# EAGLE design CharlieplexNameTag (EAGLE 7.5.0)
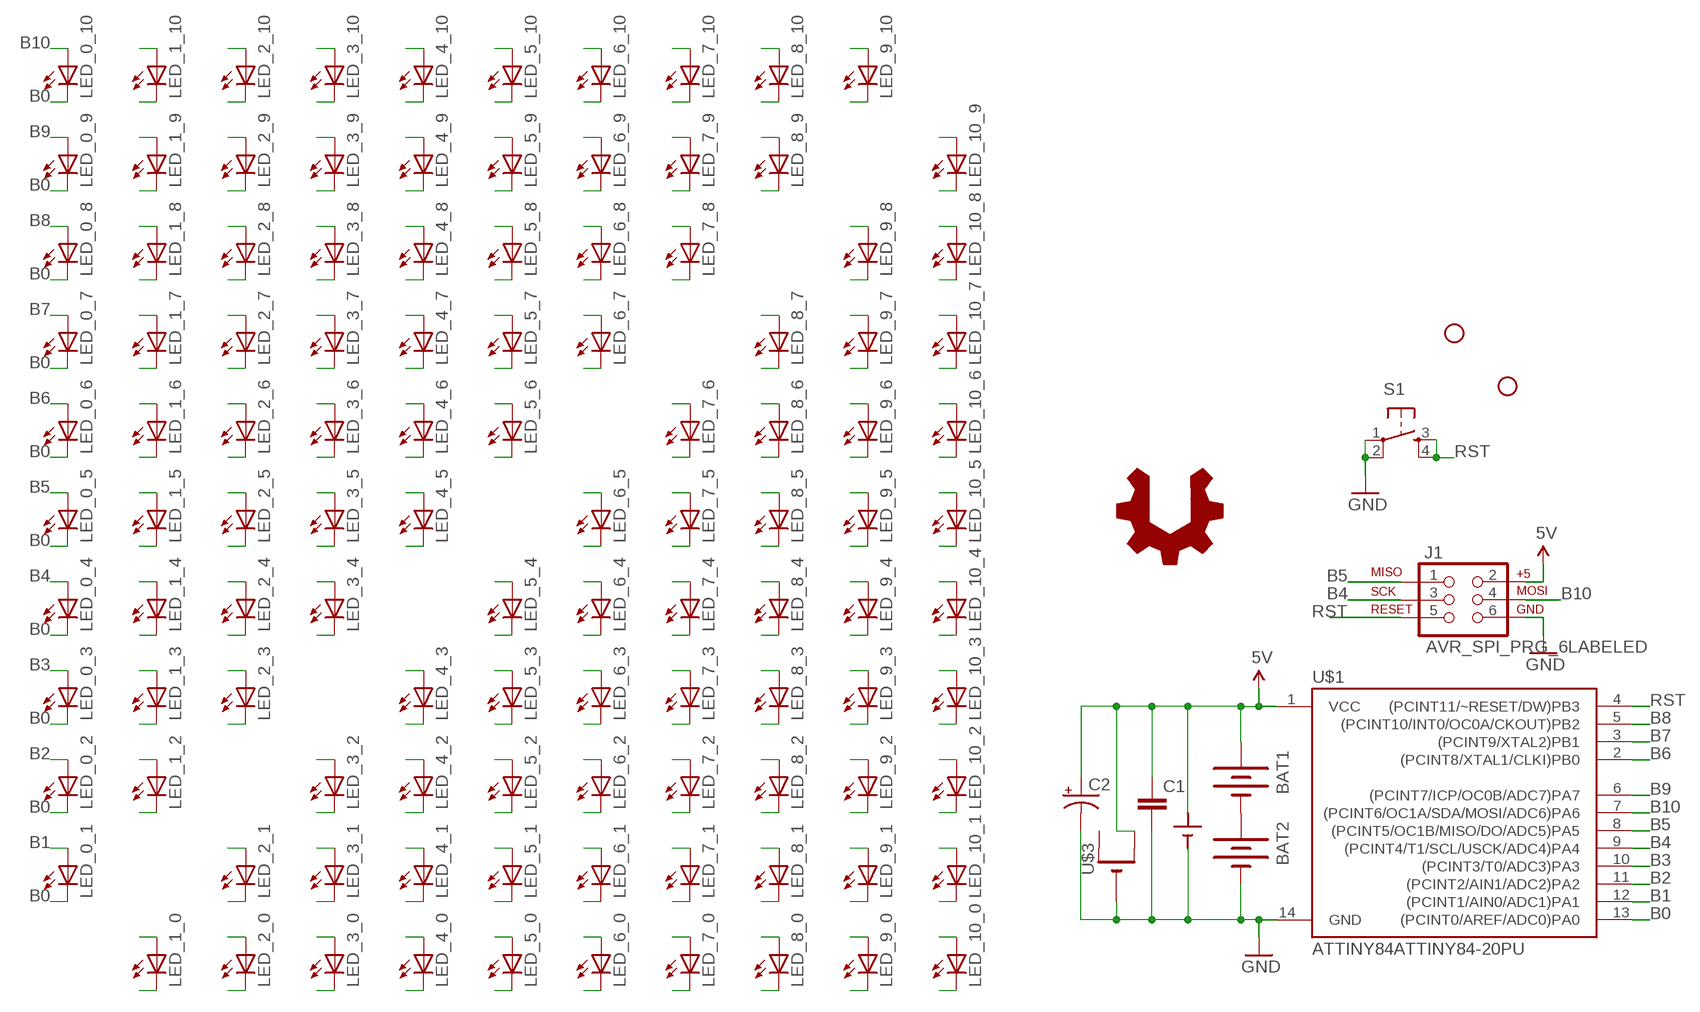
[diagram p0: schematic, sheet 1]

## Parts
BAT1  BATTERYAAA  [BATTERY-AAA]
BAT2  BATTERYAAA  [BATTERY-AAA]
C1  CAPPTH  [CAP-PTH-SMALL]
C2  CAP_POLPTH1  [CPOL-RADIAL-100UF-25V]
J1  AVR_SPI_PRG_6LABELED  [2X3-NS]
LED_0_1  LEDOVAL  [LED-OVAL]
LED_0_2  LEDOVAL  [LED-OVAL]
LED_0_3  LEDOVAL  [LED-OVAL]
LED_0_4  LEDOVAL  [LED-OVAL]
LED_0_5  LEDOVAL  [LED-OVAL]
LED_0_6  LEDOVAL  [LED-OVAL]
LED_0_7  LEDOVAL  [LED-OVAL]
LED_0_8  LEDOVAL  [LED-OVAL]
LED_0_9  LEDOVAL  [LED-OVAL]
LED_0_10  LEDOVAL  [LED-OVAL]
LED_1_0  LEDOVAL  [LED-OVAL]
LED_1_2  LEDOVAL  [LED-OVAL]
LED_1_3  LEDOVAL  [LED-OVAL]
LED_1_4  LEDOVAL  [LED-OVAL]
LED_1_5  LEDOVAL  [LED-OVAL]
LED_1_6  LEDOVAL  [LED-OVAL]
LED_1_7  LEDOVAL  [LED-OVAL]
LED_1_8  LEDOVAL  [LED-OVAL]
LED_1_9  LEDOVAL  [LED-OVAL]
LED_1_10  LEDOVAL  [LED-OVAL]
LED_2_0  LEDOVAL  [LED-OVAL]
LED_2_1  LEDOVAL  [LED-OVAL]
LED_2_3  LEDOVAL  [LED-OVAL]
LED_2_4  LEDOVAL  [LED-OVAL]
LED_2_5  LEDOVAL  [LED-OVAL]
LED_2_6  LEDOVAL  [LED-OVAL]
LED_2_7  LEDOVAL  [LED-OVAL]
LED_2_8  LEDOVAL  [LED-OVAL]
LED_2_9  LEDOVAL  [LED-OVAL]
LED_2_10  LEDOVAL  [LED-OVAL]
LED_3_0  LEDOVAL  [LED-OVAL]
LED_3_1  LEDOVAL  [LED-OVAL]
LED_3_2  LEDOVAL  [LED-OVAL]
LED_3_4  LEDOVAL  [LED-OVAL]
LED_3_5  LEDOVAL  [LED-OVAL]
LED_3_6  LEDOVAL  [LED-OVAL]
LED_3_7  LEDOVAL  [LED-OVAL]
LED_3_8  LEDOVAL  [LED-OVAL]
LED_3_9  LEDOVAL  [LED-OVAL]
LED_3_10  LEDOVAL  [LED-OVAL]
LED_4_0  LEDOVAL  [LED-OVAL]
LED_4_1  LEDOVAL  [LED-OVAL]
LED_4_2  LEDOVAL  [LED-OVAL]
LED_4_3  LEDOVAL  [LED-OVAL]
LED_4_5  LEDOVAL  [LED-OVAL]
LED_4_6  LEDOVAL  [LED-OVAL]
LED_4_7  LEDOVAL  [LED-OVAL]
LED_4_8  LEDOVAL  [LED-OVAL]
LED_4_9  LEDOVAL  [LED-OVAL]
LED_4_10  LEDOVAL  [LED-OVAL]
LED_5_0  LEDOVAL  [LED-OVAL]
LED_5_1  LEDOVAL  [LED-OVAL]
LED_5_2  LEDOVAL  [LED-OVAL]
LED_5_3  LEDOVAL  [LED-OVAL]
LED_5_4  LEDOVAL  [LED-OVAL]
LED_5_6  LEDOVAL  [LED-OVAL]
LED_5_7  LEDOVAL  [LED-OVAL]
LED_5_8  LEDOVAL  [LED-OVAL]
LED_5_9  LEDOVAL  [LED-OVAL]
LED_5_10  LEDOVAL  [LED-OVAL]
LED_6_0  LEDOVAL  [LED-OVAL]
LED_6_1  LEDOVAL  [LED-OVAL]
LED_6_2  LEDOVAL  [LED-OVAL]
LED_6_3  LEDOVAL  [LED-OVAL]
LED_6_4  LEDOVAL  [LED-OVAL]
LED_6_5  LEDOVAL  [LED-OVAL]
LED_6_7  LEDOVAL  [LED-OVAL]
LED_6_8  LEDOVAL  [LED-OVAL]
LED_6_9  LEDOVAL  [LED-OVAL]
LED_6_10  LEDOVAL  [LED-OVAL]
LED_7_0  LEDOVAL  [LED-OVAL]
LED_7_1  LEDOVAL  [LED-OVAL]
LED_7_2  LEDOVAL  [LED-OVAL]
LED_7_3  LEDOVAL  [LED-OVAL]
LED_7_4  LEDOVAL  [LED-OVAL]
LED_7_5  LEDOVAL  [LED-OVAL]
LED_7_6  LEDOVAL  [LED-OVAL]
LED_7_8  LEDOVAL  [LED-OVAL]
LED_7_9  LEDOVAL  [LED-OVAL]
LED_7_10  LEDOVAL  [LED-OVAL]
LED_8_0  LEDOVAL  [LED-OVAL]
LED_8_1  LEDOVAL  [LED-OVAL]
LED_8_2  LEDOVAL  [LED-OVAL]
LED_8_3  LEDOVAL  [LED-OVAL]
LED_8_4  LEDOVAL  [LED-OVAL]
LED_8_5  LEDOVAL  [LED-OVAL]
LED_8_6  LEDOVAL  [LED-OVAL]
LED_8_7  LEDOVAL  [LED-OVAL]
LED_8_9  LEDOVAL  [LED-OVAL]
LED_8_10  LEDOVAL  [LED-OVAL]
LED_9_0  LEDOVAL  [LED-OVAL]
LED_9_1  LEDOVAL  [LED-OVAL]
LED_9_2  LEDOVAL  [LED-OVAL]
LED_9_3  LEDOVAL  [LED-OVAL]
LED_9_4  LEDOVAL  [LED-OVAL]
LED_9_5  LEDOVAL  [LED-OVAL]
LED_9_6  LEDOVAL  [LED-OVAL]
LED_9_7  LEDOVAL  [LED-OVAL]
LED_9_8  LEDOVAL  [LED-OVAL]
LED_9_10  LEDOVAL  [LED-OVAL]
LED_10_0  LEDOVAL  [LED-OVAL]
LED_10_1  LEDOVAL  [LED-OVAL]
LED_10_2  LEDOVAL  [LED-OVAL]
LED_10_3  LEDOVAL  [LED-OVAL]
LED_10_4  LEDOVAL  [LED-OVAL]
LED_10_5  LEDOVAL  [LED-OVAL]
LED_10_6  LEDOVAL  [LED-OVAL]
LED_10_7  LEDOVAL  [LED-OVAL]
LED_10_8  LEDOVAL  [LED-OVAL]
LED_10_9  LEDOVAL  [LED-OVAL]
S1  TAC_SWITCHPTH  [TACTILE-PTH]
STANDOFF1  STAND-OFF  [STAND-OFF]
STANDOFF4  STAND-OFF  [STAND-OFF]
U$1  ATTINY84ATTINY84-20PU  [DIL14]
U$2  BATT2AAA  [BC2AAAPC]
U$3  CR2032THM  [CR2032-THRU]
U$4  USER_HACKABLE  [USER_HACKABLE]

## Nets
5V: BAT1.PWR@1(+) C1.1 C2.1(+) J1.2(V+) U$1.1(VCC) U$2.+ U$3.+2(+1)
B0: LED_0_1.CATHODE(C) LED_0_2.CATHODE(C) LED_0_3.CATHODE(C) LED_0_4.CATHODE(C) LED_0_5.CATHODE(C) LED_0_6.CATHODE(C) LED_0_7.CATHODE(C) LED_0_8.CATHODE(C) LED_0_9.CATHODE(C) LED_0_10.CATHODE(C) LED_1_0.ANODE(A) LED_2_0.ANODE(A) LED_3_0.ANODE(A) LED_4_0.ANODE(A) LED_5_0.ANODE(A) LED_6_0.ANODE(A) LED_7_0.ANODE(A) LED_8_0.ANODE(A) LED_9_0.ANODE(A) LED_10_0.ANODE(A) U$1.13((PCINT0/AREF/ADC0)PA0)
B1: LED_0_1.ANODE(A) LED_1_0.CATHODE(C) LED_1_2.CATHODE(C) LED_1_3.CATHODE(C) LED_1_4.CATHODE(C) LED_1_5.CATHODE(C) LED_1_6.CATHODE(C) LED_1_7.CATHODE(C) LED_1_8.CATHODE(C) LED_1_9.CATHODE(C) LED_1_10.CATHODE(C) LED_2_1.ANODE(A) LED_3_1.ANODE(A) LED_4_1.ANODE(A) LED_5_1.ANODE(A) LED_6_1.ANODE(A) LED_7_1.ANODE(A) LED_8_1.ANODE(A) LED_9_1.ANODE(A) LED_10_1.ANODE(A) U$1.12((PCINT1/AIN0/ADC1)PA1)
B2: LED_0_2.ANODE(A) LED_1_2.ANODE(A) LED_2_0.CATHODE(C) LED_2_1.CATHODE(C) LED_2_3.CATHODE(C) LED_2_4.CATHODE(C) LED_2_5.CATHODE(C) LED_2_6.CATHODE(C) LED_2_7.CATHODE(C) LED_2_8.CATHODE(C) LED_2_9.CATHODE(C) LED_2_10.CATHODE(C) LED_3_2.ANODE(A) LED_4_2.ANODE(A) LED_5_2.ANODE(A) LED_6_2.ANODE(A) LED_7_2.ANODE(A) LED_8_2.ANODE(A) LED_9_2.ANODE(A) LED_10_2.ANODE(A) U$1.11((PCINT2/AIN1/ADC2)PA2)
B3: LED_0_3.ANODE(A) LED_1_3.ANODE(A) LED_2_3.ANODE(A) LED_3_0.CATHODE(C) LED_3_1.CATHODE(C) LED_3_2.CATHODE(C) LED_3_4.CATHODE(C) LED_3_5.CATHODE(C) LED_3_6.CATHODE(C) LED_3_7.CATHODE(C) LED_3_8.CATHODE(C) LED_3_9.CATHODE(C) LED_3_10.CATHODE(C) LED_4_3.ANODE(A) LED_5_3.ANODE(A) LED_6_3.ANODE(A) LED_7_3.ANODE(A) LED_8_3.ANODE(A) LED_9_3.ANODE(A) LED_10_3.ANODE(A) U$1.10((PCINT3/T0/ADC3)PA3)
B4: J1.3(SCK) LED_0_4.ANODE(A) LED_1_4.ANODE(A) LED_2_4.ANODE(A) LED_3_4.ANODE(A) LED_4_0.CATHODE(C) LED_4_1.CATHODE(C) LED_4_2.CATHODE(C) LED_4_3.CATHODE(C) LED_4_5.CATHODE(C) LED_4_6.CATHODE(C) LED_4_7.CATHODE(C) LED_4_8.CATHODE(C) LED_4_9.CATHODE(C) LED_4_10.CATHODE(C) LED_5_4.ANODE(A) LED_6_4.ANODE(A) LED_7_4.ANODE(A) LED_8_4.ANODE(A) LED_9_4.ANODE(A) LED_10_4.ANODE(A) U$1.9((PCINT4/T1/SCL/USCK/ADC4)PA4)
B5: J1.1(MISO) LED_0_5.ANODE(A) LED_1_5.ANODE(A) LED_2_5.ANODE(A) LED_3_5.ANODE(A) LED_4_5.ANODE(A) LED_5_0.CATHODE(C) LED_5_1.CATHODE(C) LED_5_2.CATHODE(C) LED_5_3.CATHODE(C) LED_5_4.CATHODE(C) LED_5_6.CATHODE(C) LED_5_7.CATHODE(C) LED_5_8.CATHODE(C) LED_5_9.CATHODE(C) LED_5_10.CATHODE(C) LED_6_5.ANODE(A) LED_7_5.ANODE(A) LED_8_5.ANODE(A) LED_9_5.ANODE(A) LED_10_5.ANODE(A) U$1.8((PCINT5/OC1B/MISO/DO/ADC5)PA5)
B6: LED_0_6.ANODE(A) LED_1_6.ANODE(A) LED_2_6.ANODE(A) LED_3_6.ANODE(A) LED_4_6.ANODE(A) LED_5_6.ANODE(A) LED_6_0.CATHODE(C) LED_6_1.CATHODE(C) LED_6_2.CATHODE(C) LED_6_3.CATHODE(C) LED_6_4.CATHODE(C) LED_6_5.CATHODE(C) LED_6_7.CATHODE(C) LED_6_8.CATHODE(C) LED_6_9.CATHODE(C) LED_6_10.CATHODE(C) LED_7_6.ANODE(A) LED_8_6.ANODE(A) LED_9_6.ANODE(A) LED_10_6.ANODE(A) U$1.2((PCINT8/XTAL1/CLKI)PB0)
B7: LED_0_7.ANODE(A) LED_1_7.ANODE(A) LED_2_7.ANODE(A) LED_3_7.ANODE(A) LED_4_7.ANODE(A) LED_5_7.ANODE(A) LED_6_7.ANODE(A) LED_7_0.CATHODE(C) LED_7_1.CATHODE(C) LED_7_2.CATHODE(C) LED_7_3.CATHODE(C) LED_7_4.CATHODE(C) LED_7_5.CATHODE(C) LED_7_6.CATHODE(C) LED_7_8.CATHODE(C) LED_7_9.CATHODE(C) LED_7_10.CATHODE(C) LED_8_7.ANODE(A) LED_9_7.ANODE(A) LED_10_7.ANODE(A) U$1.3((PCINT9/XTAL2)PB1)
B8: LED_0_8.ANODE(A) LED_1_8.ANODE(A) LED_2_8.ANODE(A) LED_3_8.ANODE(A) LED_4_8.ANODE(A) LED_5_8.ANODE(A) LED_6_8.ANODE(A) LED_7_8.ANODE(A) LED_8_0.CATHODE(C) LED_8_1.CATHODE(C) LED_8_2.CATHODE(C) LED_8_3.CATHODE(C) LED_8_4.CATHODE(C) LED_8_5.CATHODE(C) LED_8_6.CATHODE(C) LED_8_7.CATHODE(C) LED_8_9.CATHODE(C) LED_8_10.CATHODE(C) LED_9_8.ANODE(A) LED_10_8.ANODE(A) U$1.5((PCINT10/INT0/OC0A/CKOUT)PB2)
B9: LED_0_9.ANODE(A) LED_1_9.ANODE(A) LED_2_9.ANODE(A) LED_3_9.ANODE(A) LED_4_9.ANODE(A) LED_5_9.ANODE(A) LED_6_9.ANODE(A) LED_7_9.ANODE(A) LED_8_9.ANODE(A) LED_9_0.CATHODE(C) LED_9_1.CATHODE(C) LED_9_2.CATHODE(C) LED_9_3.CATHODE(C) LED_9_4.CATHODE(C) LED_9_5.CATHODE(C) LED_9_6.CATHODE(C) LED_9_7.CATHODE(C) LED_9_8.CATHODE(C) LED_9_10.CATHODE(C) LED_10_9.ANODE(A) U$1.6((PCINT7/ICP/OC0B/ADC7)PA7)
B10: J1.4(MOSI) LED_0_10.ANODE(A) LED_1_10.ANODE(A) LED_2_10.ANODE(A) LED_3_10.ANODE(A) LED_4_10.ANODE(A) LED_5_10.ANODE(A) LED_6_10.ANODE(A) LED_7_10.ANODE(A) LED_8_10.ANODE(A) LED_9_10.ANODE(A) LED_10_0.CATHODE(C) LED_10_1.CATHODE(C) LED_10_2.CATHODE(C) LED_10_3.CATHODE(C) LED_10_4.CATHODE(C) LED_10_5.CATHODE(C) LED_10_6.CATHODE(C) LED_10_7.CATHODE(C) LED_10_8.CATHODE(C) LED_10_9.CATHODE(C) U$1.7((PCINT6/OC1A/SDA/MOSI/ADC6)PA6)
GND: BAT2.GND@1(-) C1.2 C2.2(-) J1.6(GND) S1.1 S1.2 U$1.14(GND) U$2.- U$3.-
N$2: BAT1.GND@1(-) BAT2.PWR@1(+)
RST: J1.5(RST) S1.3 S1.4 U$1.4((PCINT11/~RESET/DW)PB3)
Unconnected: U$3.+1(+)

## Library data of the parts
BAT1 BAT2 = SparkFun-Electromechanical:BATTERY: Battery Holders Various common sizes : AA, AAA, 20mm coin cell and 12mm coin cell. 20MM_4LEGS, BATT-10373; PROD_ID: BATT-08571
C1 = barbary_enterprises:CAP: Capacitor Standard 0603 ceramic capacitor, and 0.1" leaded capacitor.
C2 = barbary_enterprises:CAP_POL: Capacitor Polarized These are standard SMD and PTH capacitors. Normally 10uF, 47uF, and 100uF in electrolytic and tantalum varieties. Always verify the external diameter of the through hole cap, it varies with capacity, voltage, and manufacturer. The EIA devices should be standard.
J1 = barbary_enterprises:AVR_SPI_PRG_6: AVR ISP 6 Pin This is the reduced ISP connector for AVR programming. Common on Arduino. This footprint will take up less PCB space and can be used with a 10-pin to 6-pin adapter such as SKU: BOB-08508
LED_0_1-LED_0_10 LED_1_0 LED_1_2-LED_1_10 LED_2_0 LED_2_1 LED_2_3-LED_2_10 LED_3_0 LED_3_1 LED_3_2 LED_3_4-LED_3_10 LED_4_0 LED_4_1-LED_4_3 LED_4_5-LED_4_10 LED_5_0 LED_5_1-LED_5_4 LED_5_6-LED_5_10 LED_6_0 LED_6_1-LED_6_5 LED_6_7-LED_6_10 LED_7_0 LED_7_1-LED_7_6 LED_7_8-LED_7_10 LED_8_0 LED_8_1-LED_8_7 LED_8_9 LED_8_10 LED_9_0 LED_9_1-LED_9_8 LED_9_10 LED_10_0 LED_10_1-LED_10_9 = barbary_enterprises:LED: LEDs Standard schematic elements and footprints for 5mm, 3mm, 1206, and 0603 sized LEDs. 5mm - Spark Fun Electronics SKU : COM-00529 (and others)
S1 = barbary_enterprises:TAC_SWITCH: Momentary Switch Button commonly used for reset or general input. Spark Fun Electronics SKU : COM-00097 SMT- SWCH-08247
STANDOFF1 STANDOFF4 = SparkFun-Electromechanical:STAND-OFF: #4 Stand Off This is the mechanical footprint for a #4 phillips button head screw. Use the keepout ring to avoid running the screw head into surrounding components. SKU : PRT-00447
U$1 = SparkFun-DigitalIC:ATTINY84: Atmel 14-pin 2/4/8kB flash uC
U$2 = battery:BATT
U$3 = battery:CR2032
U$4 = logo:USER_HACKABLE

## Board
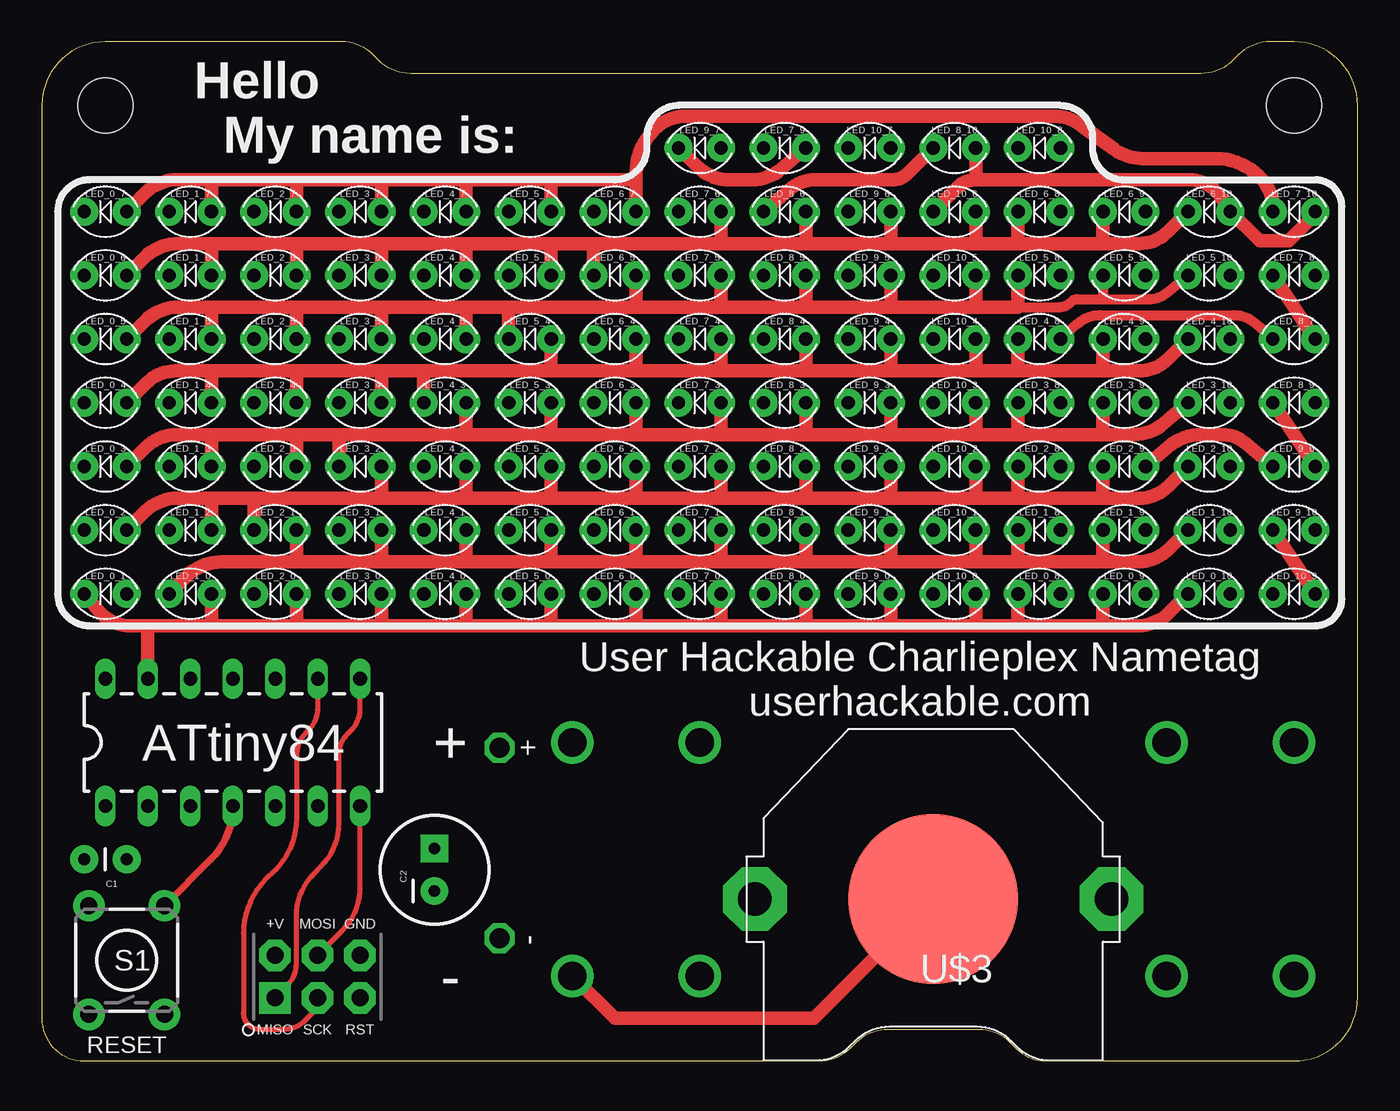
[diagram p1: board, top side]
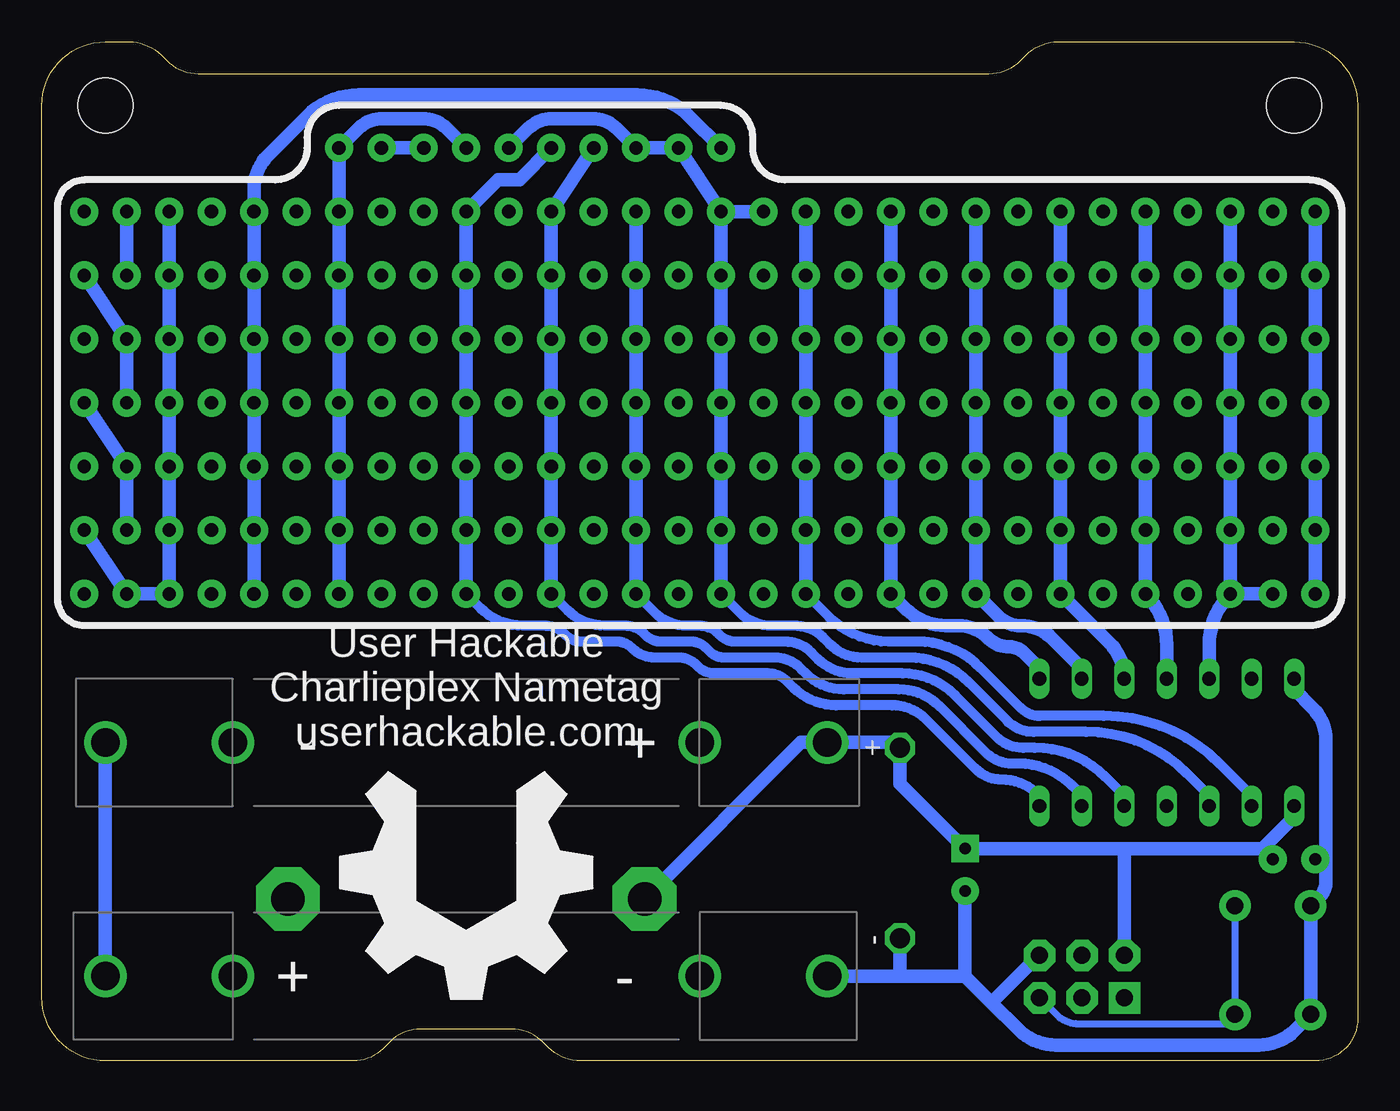
[diagram p2: board, bottom side, seen from below]

Size 78.74 x 60.96 mm. Coordinates in mm from the lower left corner, seen from the top.
Outline: 0,57.15 0,2.54 arc90 2.54,0 46.51,0 arc45 48.41,0.79 48.74,1.12 arc-45 50.65,1.91 56.08,1.91 arc-45 57.91,1.15 58.33,0.73 arc45 60.08,0 74.93,0 arc90 78.74,3.81 78.74,57.15 arc90 74.93,60.96 73.51,60.96 arc45 71.6,60.17 71.27,59.84 arc-45 69.37,59.05 22.07,59.05 arc-45 20.17,59.84 19.84,60.17 arc45 17.93,60.96 3.81,60.96 arc90 0,57.15
Copper layers (1*16): Top 0.0356mm / dielectric 1.5011mm / Bottom 0.0356mm
Design rules "LaenPCBOrder": minimum track width 6mil, minimum drill 13mil, track to track 6mil, track to pad 6mil, pad to pad 6mil, via to via 6mil, smd to smd 6mil, copper to edge 15mil, drill to drill 6mil, minimum pad ring 7mil, minimum via ring 7mil, stop-mask expansion 3mil, vias tented up to drill 0mil, thermal gap 10mil

### Footprints (pad centres in the part's own frame; a part is rotated, then mirrored left to right if it is on the bottom)
BATTERY-AAA = drill 1.702: GND@1 21.59,0; GND@2 13.97,0; PWR@1 -21.59,0; PWR@2 -13.97,0
CAP-PTH-SMALL = drill 0.7 pad 1.651: 1 0,0; 2 2.54,0
CPOL-RADIAL-100UF-25V = drill 0.7 pad 1.651 square: 1 1.27,0 | drill 0.7 pad 1.651: 2 -1.27,0
2X3-NS = drill 1.016 pad 1.88 square: 1 -2.54,-1.27 | drill 1.016 pad 1.88 octagon: 2 -2.54,1.27; 3 0,-1.27; 4 0,1.27; 5 2.54,-1.27; 6 2.54,1.27
LED-OVAL = drill 0.8 pad 1.676: ANODE 1.27,0; CATHODE -1.27,0
TACTILE-PTH = drill 1.016 pad 1.88: 1 -3.251,2.261; 2 3.251,2.261; 3 -3.251,-2.261; 4 3.251,-2.261
STAND-OFF = hole 3.302: 0,0
DIL14 = drill 0.813 long: 1 -8.89,-3.81; 2 -6.35,-3.81; 3 -3.81,-3.81; 4 -1.27,-3.81; 5 1.27,-3.81; 6 3.81,-3.81; 7 6.35,-3.81; 8 6.35,3.81; 9 3.81,3.81; 10 1.27,3.81; 11 -1.27,3.81; 12 -3.81,3.81; 13 -6.35,3.81; 14 -8.89,3.81
BC2AAAPC = drill 1.2 octagon: + 1.83,6.51; - 1.83,17.89
CR2032-THRU = drill 2 pad 3.81 octagon: +1 -10.668,0; +2 10.668,0 | smd 10.16 x 10.16: - 0,0

### Placement (x,y rotation side)
BAT1  53.34,19.05 180 bottom
BAT2  53.34,5.08 0 bottom
C1  5.08,12.06 180 top
C2  23.5,11.43 90 top
J1  16.5,5.04 0 top
LED_0_1  3.81,27.94 0 top
LED_0_2  3.81,31.75 0 top
LED_0_3  3.81,35.56 0 top
LED_0_4  3.81,39.37 0 top
LED_0_5  3.81,43.18 0 top
LED_0_6  3.81,46.99 0 top
LED_0_7  3.81,50.8 0 top
LED_0_8  59.69,27.94 0 top
LED_0_9  64.77,27.94 0 top
LED_0_10  69.85,27.94 0 top
LED_1_0  8.89,27.94 0 top
LED_1_2  8.89,31.75 0 top
LED_1_3  8.89,35.56 0 top
LED_1_4  8.89,39.37 0 top
LED_1_5  8.89,43.18 0 top
LED_1_6  8.89,46.99 0 top
LED_1_7  8.89,50.8 0 top
LED_1_8  59.69,31.75 0 top
LED_1_9  64.77,31.75 0 top
LED_1_10  69.85,31.75 0 top
LED_2_0  13.97,27.94 0 top
LED_2_1  13.97,31.75 0 top
LED_2_3  13.97,35.56 0 top
LED_2_4  13.97,39.37 0 top
LED_2_5  13.97,43.18 0 top
LED_2_6  13.97,46.99 0 top
LED_2_7  13.97,50.8 0 top
LED_2_8  59.69,35.56 0 top
LED_2_9  64.77,35.56 0 top
LED_2_10  69.85,35.56 0 top
LED_3_0  19.05,27.94 0 top
LED_3_1  19.05,31.75 0 top
LED_3_2  19.05,35.56 0 top
LED_3_4  19.05,39.37 0 top
LED_3_5  19.05,43.18 0 top
LED_3_6  19.05,46.99 0 top
LED_3_7  19.05,50.8 0 top
LED_3_8  59.69,39.37 0 top
LED_3_9  64.77,39.37 0 top
LED_3_10  69.85,39.37 0 top
LED_4_0  24.13,27.94 0 top
LED_4_1  24.13,31.75 0 top
LED_4_2  24.13,35.56 0 top
LED_4_3  24.13,39.37 0 top
LED_4_5  24.13,43.18 0 top
LED_4_6  24.13,46.99 0 top
LED_4_7  24.13,50.8 0 top
LED_4_8  59.69,43.18 0 top
LED_4_9  64.77,43.18 0 top
LED_4_10  69.85,43.18 0 top
LED_5_0  29.21,27.94 0 top
LED_5_1  29.21,31.75 0 top
LED_5_2  29.21,35.56 0 top
LED_5_3  29.21,39.37 0 top
LED_5_4  29.21,43.18 0 top
LED_5_6  29.21,46.99 0 top
LED_5_7  29.21,50.8 0 top
LED_5_8  59.69,46.99 0 top
LED_5_9  64.77,46.99 0 top
LED_5_10  69.85,46.99 0 top
LED_6_0  34.29,27.94 0 top
LED_6_1  34.29,31.75 0 top
LED_6_2  34.29,35.56 0 top
LED_6_3  34.29,39.37 0 top
LED_6_4  34.29,43.18 0 top
LED_6_5  34.29,46.99 0 top
LED_6_7  34.29,50.8 0 top
LED_6_8  59.69,50.8 0 top
LED_6_9  64.77,50.8 0 top
LED_6_10  69.85,50.8 0 top
LED_7_0  39.37,27.94 0 top
LED_7_1  39.37,31.75 0 top
LED_7_2  39.37,35.56 0 top
LED_7_3  39.37,39.37 0 top
LED_7_4  39.37,43.18 0 top
LED_7_5  39.37,46.99 0 top
LED_7_6  39.37,50.8 0 top
LED_7_8  74.93,46.99 0 top
LED_7_9  44.45,54.61 0 top
LED_7_10  74.93,50.8 0 top
LED_8_0  44.45,27.94 0 top
LED_8_1  44.45,31.75 0 top
LED_8_2  44.45,35.56 0 top
LED_8_3  44.45,39.37 0 top
LED_8_4  44.45,43.18 0 top
LED_8_5  44.45,46.99 0 top
LED_8_6  44.45,50.8 0 top
LED_8_7  74.93,43.18 0 top
LED_8_9  74.93,39.37 0 top
LED_8_10  54.61,54.61 0 top
LED_9_0  49.53,27.94 0 top
LED_9_1  49.53,31.75 0 top
LED_9_2  49.53,35.56 0 top
LED_9_3  49.53,39.37 0 top
LED_9_4  49.53,43.18 0 top
LED_9_5  49.53,46.99 0 top
LED_9_6  49.53,50.8 0 top
LED_9_7  39.37,54.61 0 top
LED_9_8  74.93,35.56 0 top
LED_9_10  74.93,31.75 0 top
LED_10_0  54.61,27.94 0 top
LED_10_1  54.61,31.75 0 top
LED_10_2  54.61,35.56 0 top
LED_10_3  54.61,39.37 0 top
LED_10_4  54.61,43.18 0 top
LED_10_5  54.61,46.99 0 top
LED_10_6  54.61,50.8 0 top
LED_10_7  49.53,54.61 0 top
LED_10_8  59.69,54.61 0 top
LED_10_9  74.93,27.94 0 top
S1  5.08,6.03 90 top
STANDOFF1  74.93,57.15 0 top
STANDOFF4  3.81,57.15 0 top
U$1  12.7,19.05 0 top
U$2  25.56,25.24 180 bottom
U$3  53.34,9.68 180 top
U$4  53.34,11.27 0 bottom

### Tracks (layer width: path | path; a pad name or v marks a point on that pad's centre or on a via)
5V
  Bottom 0.813: 13.97,12.7 C2.1 27.39,16.59 U$2.+ 27.71,19.05 BAT1.PWR@1 33.31,19.05 U$3.+2 | 13.97,12.7 5.71,12.7 | 5.71,12.7 3.81,14.61 U$1.1 | J1.2 13.96,12.69 13.97,12.7 | C1.1 5.71,12.7
B0
  Top 0.813: LED_1_0.ANODE 10.16,26.04 | 15.24,26.04 20.32,26.04 | 20.32,26.04 25.4,26.04 | 25.4,26.04 30.48,26.04 | 30.48,26.04 35.56,26.04 | 35.56,26.04 40.64,26.04 | 40.64,26.04 45.72,26.04 | 45.72,26.04 50.8,26.04 | 50.8,26.04 55.88,26.04 | 55.88,26.04 58.42,26.04 | 58.42,26.04 63.5,26.04 | 63.5,26.04 65.56,26.04 arc45 67.46,26.82 LED_0_10.CATHODE | LED_0_9.CATHODE 63.5,26.04 | LED_0_8.CATHODE 58.42,26.04 | LED_10_0.ANODE 55.88,26.04 | LED_9_0.ANODE 50.8,26.04 | LED_8_0.ANODE 45.72,26.04 | LED_7_0.ANODE 40.64,26.04 | LED_6_0.ANODE 35.56,26.04 | LED_5_0.ANODE 30.48,26.04 | LED_4_0.ANODE 25.4,26.04 | LED_3_0.ANODE 20.32,26.04 | LED_2_0.ANODE 15.24,26.04 | 15.24,26.04 10.16,26.04 | 10.16,26.04 6.35,26.04 | 6.35,26.04 5.32,26.04 arc-50 3.37,26.95 LED_0_1.CATHODE | U$1.13 6.35,26.04
  Bottom 0.813: LED_0_1.CATHODE LED_0_2.CATHODE LED_0_3.CATHODE LED_0_4.CATHODE LED_0_5.CATHODE LED_0_6.CATHODE LED_0_7.CATHODE
B1
  Top 0.813: LED_1_10.CATHODE 67.46,30.63 arc-45 65.56,29.84 63.5,29.84 | 63.5,29.84 58.42,29.84 | 58.42,29.84 55.88,29.84 | 55.88,29.84 50.8,29.84 | 50.8,29.84 45.72,29.84 | 45.72,29.84 40.64,29.84 | 40.64,29.84 35.56,29.84 | 35.56,29.84 30.48,29.84 | 30.48,29.84 25.4,29.84 | 25.4,29.84 20.32,29.84 | 20.32,29.84 15.24,29.84 | 15.24,29.84 10.74,29.84 arc45 8.67,28.99 LED_1_0.CATHODE | LED_2_1.ANODE 15.24,29.84 | LED_3_1.ANODE 20.32,29.84 | LED_4_1.ANODE 25.4,29.84 | LED_5_1.ANODE 30.48,29.84 | LED_6_1.ANODE 35.56,29.84 | LED_7_1.ANODE 40.64,29.84 | LED_8_1.ANODE 45.72,29.84 | LED_9_1.ANODE 50.8,29.84 | LED_10_1.ANODE 55.88,29.84 | LED_1_8.CATHODE 58.42,29.84 | LED_1_9.CATHODE 63.5,29.84
  Bottom 0.813: LED_1_7.CATHODE LED_1_6.CATHODE LED_1_5.CATHODE LED_1_4.CATHODE LED_1_3.CATHODE LED_1_2.CATHODE 7.62,28.57 | 7.62,28.57 LED_1_0.CATHODE arc-45 8.89,24.87 U$1.12 | LED_0_1.ANODE 6.99,27.94 7.62,28.57
B2
  Top 0.813: LED_0_2.ANODE 6.2,32.87 arc-45 8.1,33.66 10.16,33.66 | 10.16,33.66 12.7,33.66 | 12.7,33.66 20.32,33.66 | 20.32,33.66 25.4,33.66 | 25.4,33.66 30.48,33.66 | 30.48,33.66 35.56,33.66 | 35.56,33.66 40.64,33.66 | 40.64,33.66 45.72,33.66 | 45.72,33.66 50.8,33.66 | 50.8,33.66 55.88,33.66 | 55.88,33.66 58.42,33.66 | 58.42,33.66 63.5,33.66 | 63.5,33.66 65.65,33.66 arc45 67.4,34.38 LED_2_10.CATHODE | LED_1_2.ANODE 10.16,33.66 | LED_2_1.CATHODE 12.7,33.66 | LED_2_9.CATHODE 63.5,33.66 | LED_2_8.CATHODE 58.42,33.66 | LED_10_2.ANODE 55.88,33.66 | LED_9_2.ANODE 50.8,33.66 | LED_8_2.ANODE 45.72,33.66 | LED_7_2.ANODE 40.64,33.66 | LED_6_2.ANODE 35.56,33.66 | LED_5_2.ANODE 30.48,33.66 | LED_4_2.ANODE 25.4,33.66 | LED_3_2.ANODE 20.32,33.66
  Bottom 0.813: LED_2_7.CATHODE LED_2_6.CATHODE LED_2_5.CATHODE LED_2_4.CATHODE LED_2_3.CATHODE LED_2_1.CATHODE LED_2_0.CATHODE arc45 11.43,24.87 U$1.11
B3
  Top 0.813: LED_0_3.ANODE 6.2,36.68 arc-45 8.1,37.47 10.16,37.47 | 10.16,37.47 15.24,37.47 | 15.24,37.47 17.78,37.47 | 17.78,37.47 25.4,37.47 | 25.4,37.47 30.48,37.47 | 30.48,37.47 35.56,37.47 | 35.56,37.47 40.64,37.47 | 40.64,37.47 45.72,37.47 | 45.72,37.47 50.8,37.47 | 50.8,37.47 55.88,37.47 | 55.88,37.47 58.42,37.47 | 58.42,37.47 63.5,37.47 | 63.5,37.47 65.32,37.47 arc41 67.15,38.14 LED_3_10.CATHODE | LED_4_3.ANODE 25.4,37.47 | LED_5_3.ANODE 30.48,37.47 | LED_6_3.ANODE 35.56,37.47 | LED_7_3.ANODE 40.64,37.47 | LED_8_3.ANODE 45.72,37.47 | LED_9_3.ANODE 50.8,37.47 | LED_3_9.CATHODE 63.5,37.47 | LED_3_8.CATHODE 58.42,37.47 | LED_10_3.ANODE 55.88,37.47 | LED_2_3.ANODE 15.24,37.47 | LED_3_2.CATHODE 17.78,37.47 | LED_1_3.ANODE 10.16,37.47
  Bottom 0.813: LED_3_7.CATHODE LED_3_6.CATHODE LED_3_5.CATHODE LED_3_4.CATHODE LED_3_2.CATHODE LED_3_1.CATHODE LED_3_0.CATHODE 14.87,25.03 arc45 U$1.10
B4
  Top 0.305: U$1.9 16.51,21.16 arc-45 15.91,19.73 15.77,19.58 arc45 15.24,18.31 15.24,14.56 arc-45 13.93,11.38 13.38,10.84 arc45 12.06,7.67 12.06,2.86 arc90 13.02,1.91 14.5,1.91 arc45 15.77,2.43 16.51,3.17 J1.3
  Top 0.813: LED_0_4.ANODE 6.26,40.55 arc-45 8.01,41.27 10.16,41.27 | 10.16,41.27 15.24,41.27 | 15.24,41.27 20.32,41.27 | 20.32,41.27 22.86,41.27 | 22.86,41.27 30.48,41.27 | 30.48,41.27 35.56,41.27 | 35.56,41.27 40.64,41.27 | 40.64,41.27 45.72,41.27 | 45.72,41.27 50.8,41.27 | 50.8,41.27 55.88,41.27 | 55.88,41.27 58.42,41.27 | 58.42,41.27 63.5,41.27 | 63.5,41.27 65.65,41.27 arc45 67.4,42 LED_4_10.CATHODE | LED_5_4.ANODE 30.48,41.27 | LED_6_4.ANODE 35.56,41.27 | LED_7_4.ANODE 40.64,41.27 | LED_8_4.ANODE 45.72,41.27 | LED_9_4.ANODE 50.8,41.27 | LED_10_4.ANODE 55.88,41.27 | LED_4_8.CATHODE 58.42,41.27 | LED_4_9.CATHODE 63.5,41.27 | LED_1_4.ANODE 10.16,41.27 | LED_2_4.ANODE 15.24,41.27 | LED_3_4.ANODE 20.32,41.27 | LED_4_3.CATHODE 22.86,41.27
  Bottom 0.813: LED_4_7.CATHODE LED_4_6.CATHODE LED_4_5.CATHODE LED_4_3.CATHODE LED_4_2.CATHODE LED_4_1.CATHODE LED_4_0.CATHODE 21.51,26.59 arc-45 20.17,26.04 arc45 18.26,25.25 16.51,23.5 U$1.9
B5
  Top 0.305: J1.1 13.96,3.8 14.71,4.55 arc45 15.24,5.82 15.24,8.67 arc-45 16.29,11.21 16.73,11.65 arc45 17.78,14.19 17.78,18.31 arc-45 18.31,19.58 18.52,19.79 arc45 19.05,21.06 U$1.8
  Top 0.61: 58.42,45.09 60.91,45.09 arc45 61.54,45.35 61.62,45.43 arc-45 61.94,45.56 63.5,45.56 | 63.5,45.56 66.26,45.56 arc39 67.28,45.92 LED_5_10.CATHODE | LED_5_9.CATHODE 63.5,45.56
  Top 0.813: LED_0_5.ANODE 6.13,44.23 arc-45 8.2,45.09 10.16,45.09 | 10.16,45.09 15.24,45.09 | 15.24,45.09 20.32,45.09 | 20.32,45.09 25.4,45.09 | 25.4,45.09 27.94,45.09 | 27.94,45.09 35.56,45.09 | 35.56,45.09 40.64,45.09 | 40.64,45.09 45.72,45.09 | 45.72,45.09 50.8,45.09 | 50.8,45.09 55.88,45.09 | 55.88,45.09 58.42,45.09 LED_5_8.CATHODE | LED_1_5.ANODE 10.16,45.09 | LED_2_5.ANODE 15.24,45.09 | LED_3_5.ANODE 20.32,45.09 | LED_4_5.ANODE 25.4,45.09 | LED_5_4.CATHODE 27.94,45.09 | LED_10_5.ANODE 55.88,45.09 | LED_9_5.ANODE 50.8,45.09 | LED_8_5.ANODE 45.72,45.09 | LED_7_5.ANODE 40.64,45.09 | LED_6_5.ANODE 35.56,45.09
  Bottom 0.813: LED_5_7.CATHODE LED_5_6.CATHODE LED_5_4.CATHODE LED_5_3.CATHODE LED_5_2.CATHODE LED_5_1.CATHODE LED_5_0.CATHODE 27.02,27.02 arc-45 24.64,26.04 23.89,26.04 arc45 22.13,25.31 22.12,25.29 arc-45 20.85,24.77 arc45 19.95,24.39 19.05,23.5 U$1.8
B6
  Top 0.813: LED_0_6.ANODE 6.13,48.04 arc-45 8.2,48.9 10.16,48.9 | 10.16,48.9 15.24,48.9 | 15.24,48.9 20.32,48.9 | 20.32,48.9 25.4,48.9 | 25.4,48.9 30.48,48.9 | 30.48,48.9 33.02,48.9 | 33.02,48.9 40.64,48.9 | 40.64,48.9 45.72,48.9 | 45.72,48.9 50.8,48.9 | 50.8,48.9 55.88,48.9 | 55.88,48.9 58.42,48.9 | 58.42,48.9 63.5,48.9 | 63.5,48.9 65.65,48.9 arc45 67.4,49.62 LED_6_10.CATHODE | LED_1_6.ANODE 10.16,48.9 | LED_2_6.ANODE 15.24,48.9 | LED_3_6.ANODE 20.32,48.9 | LED_4_6.ANODE 25.4,48.9 | LED_5_6.ANODE 30.48,48.9 | LED_7_6.ANODE 40.64,48.9 | LED_6_5.CATHODE 33.02,48.9 | LED_8_6.ANODE 45.72,48.9 | LED_9_6.ANODE 50.8,48.9 | LED_6_9.CATHODE 63.5,48.9 | LED_10_6.ANODE 55.88,48.9 | LED_6_8.CATHODE 58.42,48.9
  Bottom 0.61: U$1.2 6.35,15.88 8.23,17.75 arc-45 15.19,20.64 19.03,20.64 arc45 20.15,21.1 22.55,23.5 arc-45 26.37,25.08 28.06,25.08 arc45 31.65,26.57 LED_6_0.CATHODE
  Bottom 0.813: LED_6_7.CATHODE LED_6_5.CATHODE LED_6_4.CATHODE LED_6_3.CATHODE LED_6_2.CATHODE LED_6_1.CATHODE LED_6_0.CATHODE
B7
  Top 0.813: LED_0_7.ANODE 6.2,51.92 arc-45 8.1,52.7 10.16,52.7 | 10.16,52.7 15.24,52.7 | 15.24,52.7 20.32,52.7 | 20.32,52.7 25.4,52.7 | 25.4,52.7 30.48,52.7 | 30.48,52.7 35.56,52.7 | 35.56,52.7 LED_6_7.ANODE | LED_5_7.ANODE 30.48,52.7 | LED_4_7.ANODE 25.4,52.7 | LED_3_7.ANODE 20.32,52.7 | LED_1_7.ANODE 10.16,52.7 | LED_2_7.ANODE 15.24,52.7 | 35.56,52.7 35.56,53.12 arc-45 36.61,55.66 36.71,55.76 arc-45 38.53,56.52 60.52,56.52 arc-36 62.18,55.97 64.18,54.52 arc36 65.86,53.98 70.26,53.98 arc-45 72.81,52.92 72.97,52.76 arc-45 73.66,51.09 LED_7_10.CATHODE | LED_7_8.CATHODE LED_8_7.ANODE
  Bottom 0.61: U$1.3 8.89,15.88 10.19,17.17 arc-45 16.25,19.68 19.4,19.68 arc45 20.97,20.34 23.28,22.64 arc-45 26.87,24.13 29.68,24.13 arc45 31.59,24.92 31.98,25.31 arc-45 33.73,26.04 35.08,26.04 arc45 36.98,26.82 LED_7_0.CATHODE
  Bottom 0.813: LED_7_6.CATHODE LED_7_5.CATHODE LED_7_4.CATHODE LED_7_3.CATHODE LED_7_2.CATHODE LED_7_1.CATHODE LED_7_0.CATHODE | LED_6_7.ANODE LED_7_6.CATHODE | LED_7_8.CATHODE LED_7_10.CATHODE | LED_7_6.CATHODE LED_9_7.ANODE LED_7_9.CATHODE 44.32,55.75 arc-45 45.78,56.36 48.2,56.36 arc-45 49.66,55.75 LED_10_7.ANODE
B8
  Top 0.61: LED_4_8.ANODE 62,44.12 arc-42 63.28,44.61 71.34,44.61 arc-42 72.62,44.12 LED_8_7.CATHODE
  Top 0.813: LED_8_9.CATHODE LED_9_8.ANODE | LED_8_6.CATHODE 44.68,52.09 arc-41 46.35,52.7 50.91,52.7 arc45 51.81,53.08 LED_8_10.CATHODE
  Bottom 0.61: U$1.5 13.97,15.88 15.06,16.97 arc-45 19.33,18.73 20.03,18.73 arc45 21.61,19.38 24.1,21.88 arc-45 27.24,23.18 30.22,23.18 arc45 32.29,24.04 32.68,24.43 arc-45 34.27,25.08 37.23,25.08 arc45 38.18,25.48 38.27,25.57 arc-45 39.39,26.04 40.16,26.04 arc45 42.06,26.82 LED_8_0.CATHODE
  Bottom 0.813: LED_8_0.CATHODE LED_8_1.CATHODE LED_8_2.CATHODE LED_8_3.CATHODE LED_8_4.CATHODE LED_8_5.CATHODE LED_8_6.CATHODE | LED_0_8.ANODE LED_1_8.ANODE LED_2_8.ANODE LED_3_8.ANODE LED_4_8.ANODE LED_5_8.ANODE LED_6_8.ANODE LED_10_8.ANODE 59.82,55.75 arc45 58.36,56.36 55.94,56.36 arc45 54.48,55.75 LED_8_10.CATHODE | LED_8_9.CATHODE LED_8_7.CATHODE LED_7_8.ANODE
B9
  Top 0.813: LED_9_10.CATHODE LED_10_9.ANODE | LED_2_9.ANODE 67.37,36.7 arc-41 69.44,37.47 70.61,37.47 arc-41 72.06,36.93 LED_9_8.CATHODE | LED_7_9.ANODE 44.26,53.36 arc-41 42.49,52.7 41.15,52.7 arc-45 39.19,53.52 LED_9_7.CATHODE
  Bottom 0.61: U$1.6 16.51,15.88 17.11,16.48 arc-45 20.26,17.78 20.67,17.78 arc45 22.24,18.43 25.01,21.2 arc-45 27.48,22.23 30.77,22.23 arc45 32.99,23.15 33.31,23.47 arc-45 34.9,24.13 37.94,24.13 arc45 38.75,24.46 38.98,24.69 arc-45 39.93,25.08 41.67,25.08 arc45 42.62,25.48 42.72,25.57 arc-45 43.84,26.04 45.05,26.04 arc45 47.28,26.96 LED_9_0.CATHODE
  Bottom 0.813: LED_9_0.CATHODE LED_9_1.CATHODE LED_9_2.CATHODE LED_9_3.CATHODE LED_9_4.CATHODE LED_9_5.CATHODE LED_9_6.CATHODE LED_7_9.ANODE | LED_0_9.ANODE LED_1_9.ANODE LED_2_9.ANODE LED_3_9.ANODE LED_4_9.ANODE LED_5_9.ANODE LED_6_9.ANODE 66.04,52.16 arc45 65.2,54.18 62.9,56.48 arc45 59.75,57.78 43.12,57.78 arc45 39.97,56.48 LED_9_7.CATHODE | LED_9_10.CATHODE LED_9_8.CATHODE LED_8_9.ANODE
B10
  Top 0.305: J1.4 18,7.82 arc45 19.05,10.35 U$1.7
  Top 0.813: 55.88,52.7 68.66,52.7 arc-56 70.51,51.71 LED_6_10.ANODE 72.87,49.05 74.61,49.05 76.2,50.64 LED_7_10.ANODE | 55.88,52.7 arc45 54.8,52.26 LED_10_6.CATHODE | LED_8_10.ANODE 55.88,52.7
  Bottom 0.61: U$1.7 19.05,15.88 19.08,15.91 arc-45 21.3,16.83 arc45 22.88,17.48 25.83,20.44 arc-45 27.85,21.27 31.2,21.27 arc45 33.76,22.33 34.14,22.71 arc-45 35.27,23.18 38.49,23.18 arc45 39.45,23.57 39.54,23.66 arc-45 40.66,24.13 42.07,24.13 arc45 43.42,24.69 arc-45 44.37,25.08 46.43,25.08 arc45 47.38,25.48 47.4,25.49 arc-45 48.71,26.04 49.95,26.04 arc45 52.49,27.09 LED_10_0.CATHODE
  Bottom 0.813: LED_10_0.CATHODE LED_10_1.CATHODE LED_10_2.CATHODE LED_10_3.CATHODE LED_10_4.CATHODE LED_10_5.CATHODE LED_10_6.CATHODE 51.44,52.7 50.16,52.7 LED_10_7.CATHODE | LED_6_10.ANODE LED_5_10.ANODE LED_4_10.ANODE LED_3_10.ANODE LED_2_10.ANODE LED_1_10.ANODE LED_0_10.ANODE LED_10_9.CATHODE LED_9_10.ANODE | LED_8_10.ANODE LED_10_8.CATHODE
GND
  Top 0.813: U$3.- 46.2,2.54 34.29,2.54 BAT2.GND@1
  Bottom 0.813: U$1.14 3.81,22.23 2.69,21.11 arc45 1.91,19.2 1.91,12.06 | 1.91,12.06 1.91,10.71 arc45 2.27,9.84 S1.2 S1.1 3.75,1.85 arc45 5.92,0.95 18.07,0.95 arc45 20.29,1.87 21.91,3.49 | J1.6 19.09,6.31 21.91,3.49 | BAT2.GND@1 27.46,5.08 | 27.46,5.08 23.5,5.08 | 23.5,5.08 21.91,3.49 | C1.2 1.91,12.06 | C2.2 23.5,5.08 | U$2.- 27.39,5.16 27.46,5.08
N$2
  Bottom 0.813: BAT2.PWR@1 BAT1.GND@1
RST
  Top 0.406: U$1.4 arc-45 10.11,12.05 S1.4
  Bottom 0.406: J1.5 19.01,3.77 17.99,2.75 arc-45 16.72,2.22 7.9,2.22 S1.3 S1.4

### Text on the board
tPlace: Hello / My name is: | User Hackable Charlieplex Nametag / userhackable.com | ATtiny84 | + | - | RESET
bPlace: User Hackable / Charlieplex Nametag / userhackable.com